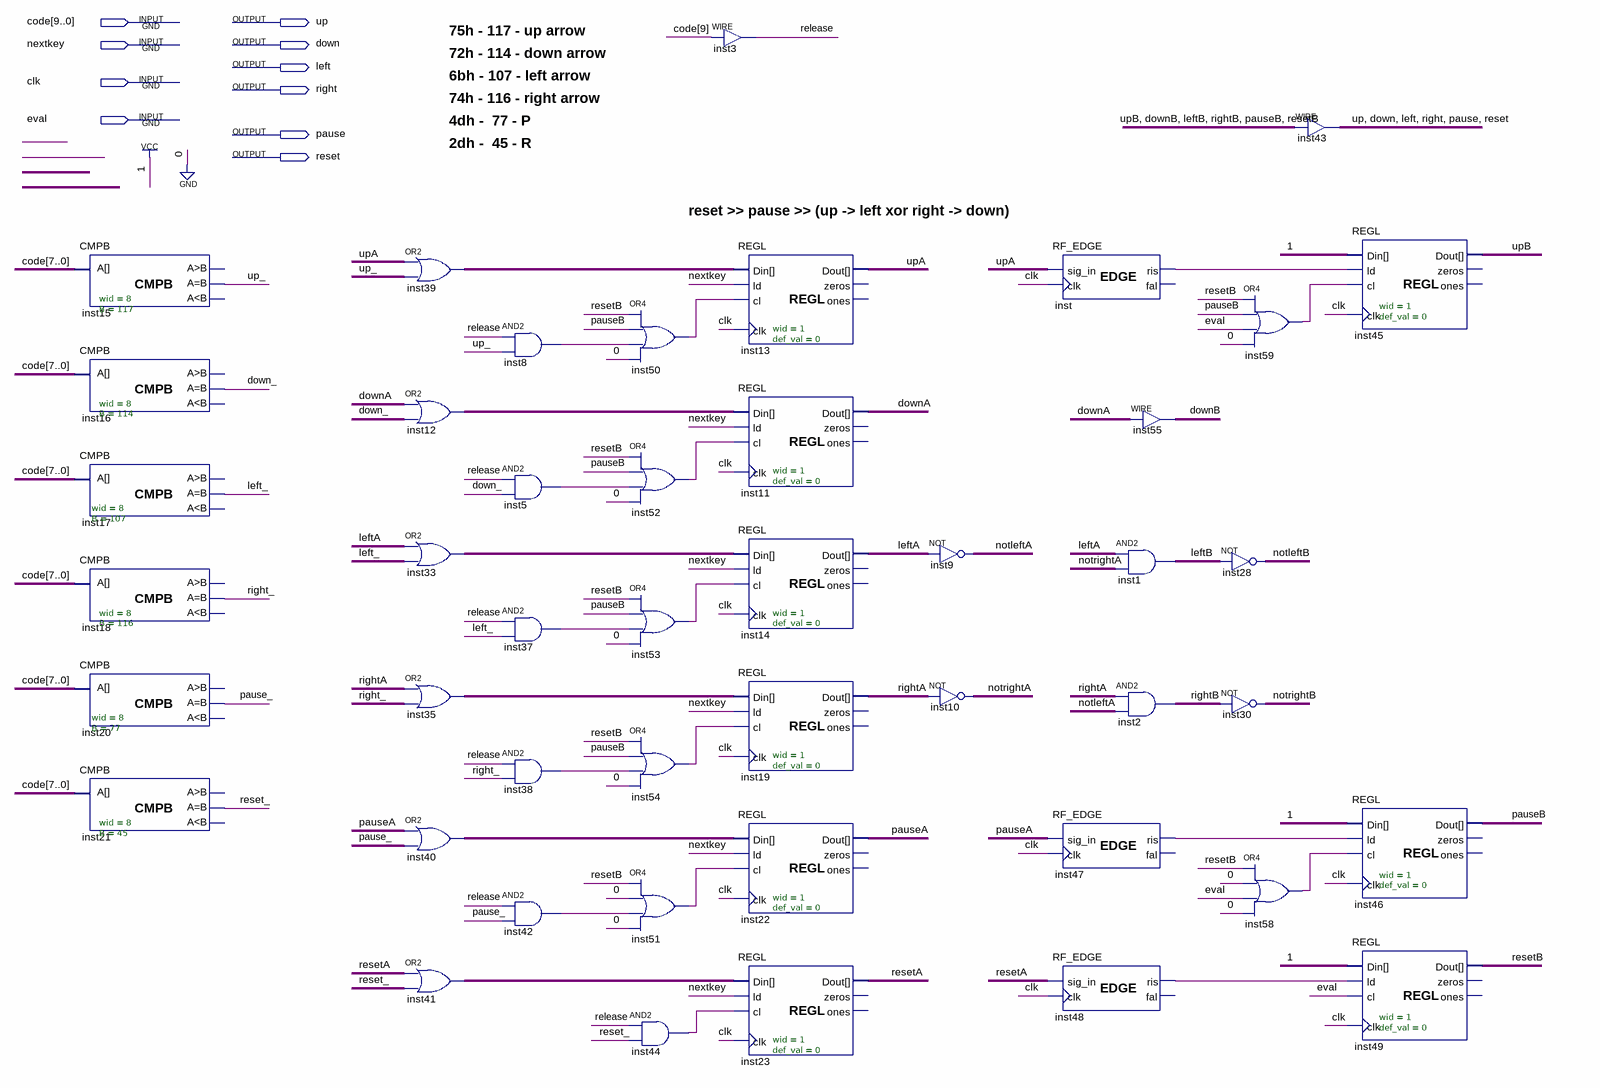
[diagram p0: schematic sheet]
// Quartus schematic key.bdf as structural Verilog: 46 symbols, 10 pins
module key (
  input  [9:0] code,
  input  nextkey,
  input  clk,
  input  eval,
  output up,
  output down,
  output left,
  output right,
  output pause,
  output reset
);

  wire down_, downA, downB, inst5_out, inst8_out, inst12_out, inst33_out, inst35_out, inst37_out, inst38_out,
       inst39_out, inst40_out, inst41_out, inst42_out, inst44_out, inst47_ris, inst48_ris, inst50_out,
       inst51_out, inst52_out, inst53_out, inst54_out, inst58_out, inst59_out, inst_ris, left_, leftA, leftB,
       notleftA, notleftB, notrightA, notrightB, pause_, pauseA, pauseB, \release , reset_, resetA, resetB,
       right_, rightA, rightB, up_, upA, upB;

  CMPB #(.wid(8), .B(117)) inst15 (.A(code[7:0]), .eq(up_));  // open: gr, ls
  CMPB #(.wid(8), .B(114)) inst16 (.A(code[7:0]), .eq(down_));  // open: gr, ls
  CMPB #(.wid(8), .B(107)) inst17 (.A(code[7:0]), .eq(left_));  // open: gr, ls
  CMPB #(.wid(8), .B(116)) inst18 (.A(code[7:0]), .eq(right_));  // open: gr, ls
  CMPB #(.wid(8), .B(77)) inst20 (.A(code[7:0]), .eq(pause_));  // open: gr, ls
  CMPB #(.wid(8), .B(45)) inst21 (.A(code[7:0]), .eq(reset_));  // open: gr, ls
  or inst39 (inst39_out, upA, up_);
  or inst12 (inst12_out, downA, down_);
  or inst33 (inst33_out, leftA, left_);
  or inst35 (inst35_out, rightA, right_);
  or inst40 (inst40_out, pauseA, pause_);
  or inst41 (inst41_out, resetA, reset_);
  and inst8 (inst8_out, \release , up_);
  and inst5 (inst5_out, \release , down_);
  and inst37 (inst37_out, \release , left_);
  and inst38 (inst38_out, \release , right_);
  and inst42 (inst42_out, \release , pause_);
  or inst50 (inst50_out, resetB, pauseB, inst8_out, 1'b0);
  or inst52 (inst52_out, resetB, pauseB, inst5_out, 1'b0);
  or inst53 (inst53_out, resetB, pauseB, inst37_out, 1'b0);
  or inst54 (inst54_out, resetB, pauseB, inst38_out, 1'b0);
  or inst51 (inst51_out, resetB, 1'b0, inst42_out, 1'b0);
  and inst44 (inst44_out, \release , reset_);
  assign \release  = code[9];  // WIRE inst3
  REGL #(.wid(1), .def_val(0)) inst13 (
    .Din(inst39_out), .ld(nextkey), .cl(inst50_out), .clk(clk), .Dout(upA));  // open: zeros, ones
  REGL #(.wid(1), .def_val(0)) inst11 (
    .Din(inst12_out), .ld(nextkey), .cl(inst52_out), .clk(clk), .Dout(downA));  // open: zeros, ones
  REGL #(.wid(1), .def_val(0)) inst14 (
    .Din(inst33_out), .ld(nextkey), .cl(inst53_out), .clk(clk), .Dout(leftA));  // open: zeros, ones
  REGL #(.wid(1), .def_val(0)) inst19 (
    .Din(inst35_out), .ld(nextkey), .cl(inst54_out), .clk(clk), .Dout(rightA));  // open: zeros, ones
  REGL #(.wid(1), .def_val(0)) inst22 (
    .Din(inst40_out), .ld(nextkey), .cl(inst51_out), .clk(clk), .Dout(pauseA));  // open: zeros, ones
  REGL #(.wid(1), .def_val(0)) inst23 (
    .Din(inst41_out), .ld(nextkey), .cl(inst44_out), .clk(clk), .Dout(resetA));  // open: zeros, ones
  not inst9 (notleftA, leftA);
  not inst10 (notrightA, rightA);
  RF_EDGE inst (.sig_in(upA), .clk(clk), .ris(inst_ris));  // open: fal
  RF_EDGE inst47 (.sig_in(pauseA), .clk(clk), .ris(inst47_ris));  // open: fal
  RF_EDGE inst48 (.sig_in(resetA), .clk(clk), .ris(inst48_ris));  // open: fal
  and inst1 (leftB, leftA, notrightA);
  and inst2 (rightB, rightA, notleftA);
  assign downB = downA;  // WIRE inst55
  or inst59 (inst59_out, resetB, pauseB, eval, 1'b0);
  not inst28 (notleftB, leftB);
  not inst30 (notrightB, rightB);
  or inst58 (inst58_out, resetB, 1'b0, eval, 1'b0);
  assign {up, down, left, right, pause, reset} = {upB, downB, leftB, rightB, pauseB, resetB};  // WIRE inst43
  REGL #(.wid(1), .def_val(0)) inst45 (
    .Din(1'b1), .ld(inst_ris), .cl(inst59_out), .clk(clk), .Dout(upB));  // open: zeros, ones
  REGL #(.wid(1), .def_val(0)) inst46 (
    .Din(1'b1), .ld(inst47_ris), .cl(inst58_out), .clk(clk), .Dout(pauseB));  // open: zeros, ones
  REGL #(.wid(1), .def_val(0)) inst49 (
    .Din(1'b1), .ld(inst48_ris), .cl(eval), .clk(clk), .Dout(resetB));  // open: zeros, ones

  // Notes on the sheet:
  //   75h - 117 - up arrow
  //   72h - 114 - down arrow
  //   6bh - 107 - left arrow
  //   74h - 116 - right arrow
  //   4dh -  77 - P
  //   2dh -  45 - R
  //   reset >> pause >> (up -> left xor right -> down)
endmodule
